# Altium schematic sheet IR_TSOP95438.SchDoc
size A3; SheetNumber: 8; SheetTotal: 22
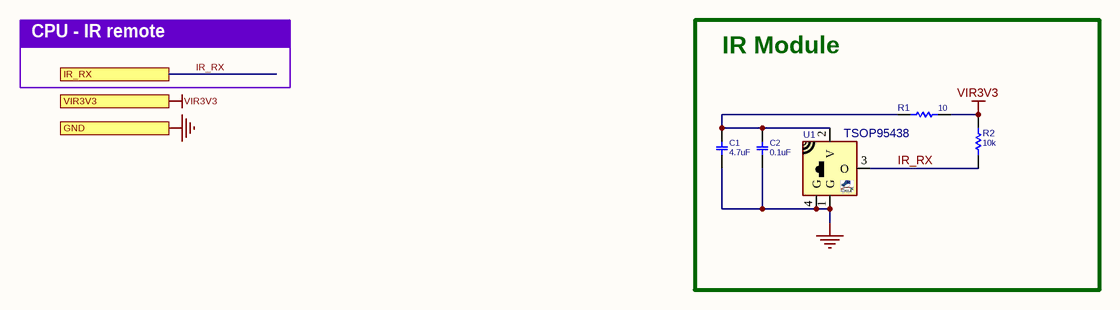
[diagram p0: IR_TSOP95438.SchDoc]

## Parts
C1  4.7uF  [C0402]
C2  0.1uF  [C0402]
R1  10  [R0402]
R2  10k  [R0402]
U1  TSOP95438  [PHM_TSOPHEIMDALL]

## Blocks framed on the sheet
IR Module: C1 C2 R1 R2 U1

## Ports
GND, IR_RX, VIR3V3

## Nets
GND: C1.1 C2.1 U1.1(G) U1.4(G) ; port GND
VIR3V3: R1.2 R2.2 ; port VIR3V3
IR_RX: R2.1 U1.3(O) ; port IR_RX
NetC1_2: C1.2 C2.2 R1.1 U1.2(V)

## Notes on the sheet
- CPU - IR remote

## Library data of the parts
C1 = CAP_SMD_MLCC: CAP, MLCC; PARAM: X5R, 20%; MANF_P#: CL05A475MP5NRNC; MANF: Samsung; PARAM2: 10v; PRICE: 10,000: $0.034; ASSEMBLY: ASSEMBLY; VALUE: 4.7uF
C2 = CAP_SMD_MLCC: CAP, MLCC; PARAM: X5R, 10%; MANF_P#: GRM155R61E104; MANF: Murata; PARAM2: 25v; PRICE: 10,000:$0.006; ASSEMBLY: ASSEMBLY; VALUE: 0.1uF
R1 R2 = RES_SMD: RESISTOR, SMD; PARAM: 0.063W; DESC: DESCRIPTION; DIST#: MOUSER; PARAM2: 1%; MANF_P#: -; MANF: -; ASSEMBLY: ASSEMBLY; PRICE: 100= 0.3$
  R1: VALUE: 10
  R2: VALUE: 10k
U1 = PHM_TSOP95438_Heimdall: IR Receiver Modules for Remote Control Systems; MANF: VISHAY; PARAM2: 2~3.6V, 10mW; PARAM: 38KHz, 25m Distance; MANF_P#: TSOP95438; PRICE: 1.8$; Value: TSOP95438